# EasyEDA Pro project ProProject_Laser_Scanner_Logic_converter_2024-06-21.epro

# Schematic Schematic1

## Sheets
1 P1: Create Date: 2024-03-26; Page Name: P1; Project Name: Laser_Scanner_Logic_converter; Schematic Name: Schematic1; Update Date: 2024-04-04; Company: EasyEDA.com; Drawn: EasyEDA; Page Size: A4; Part Number: JLCPCB-002; Reviewed: EasyEDA; Version: V0.1
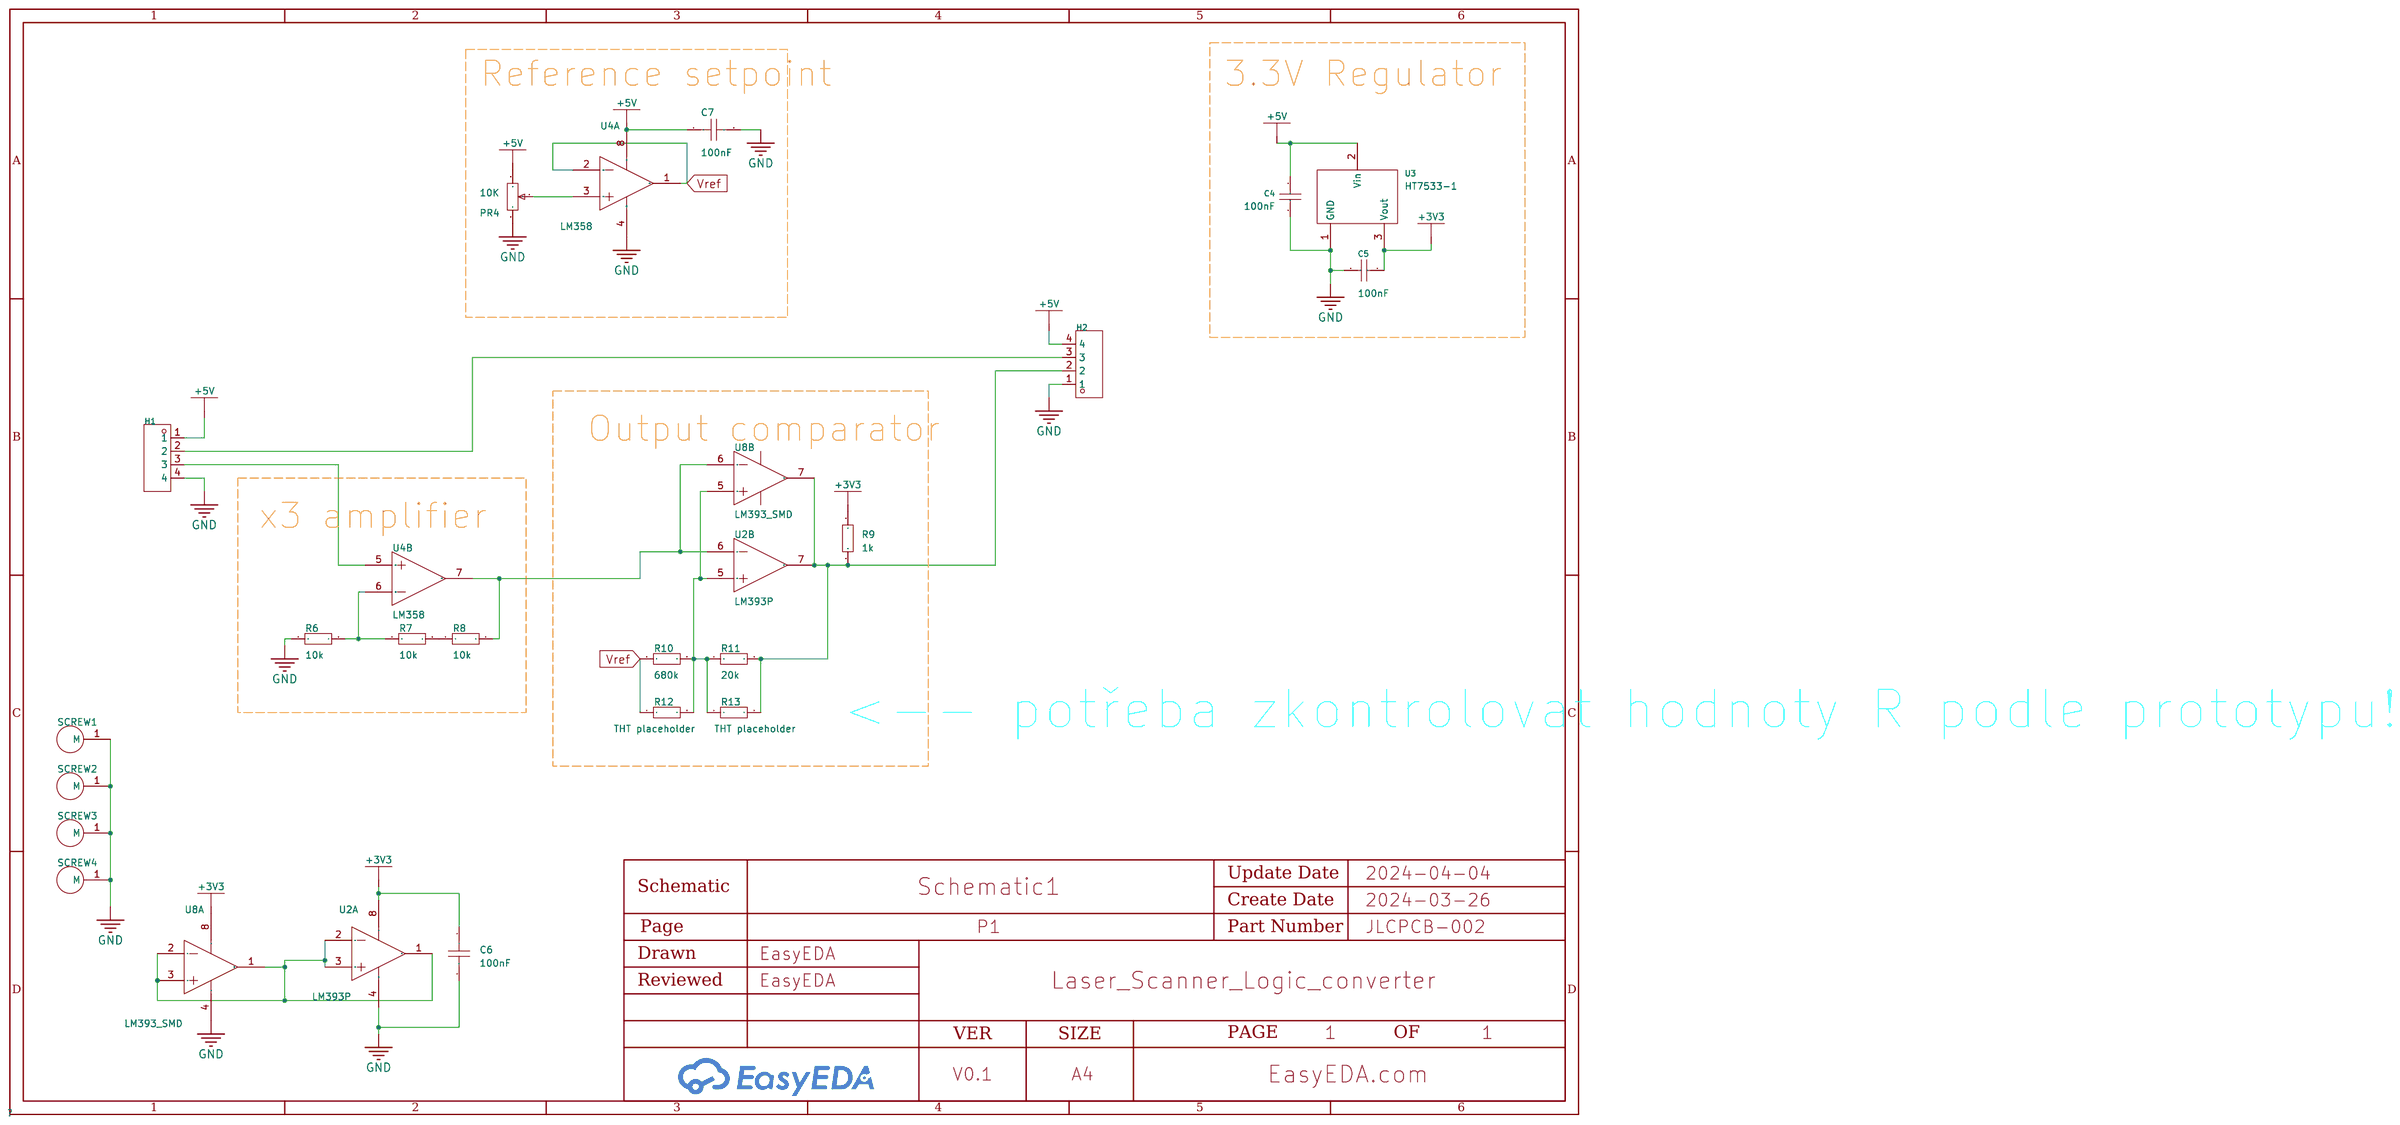
[diagram p0: P1]
2 flex breakout: Create Date: 2024-04-11; Page Name: flex breakout; Update Date: 2024-04-11
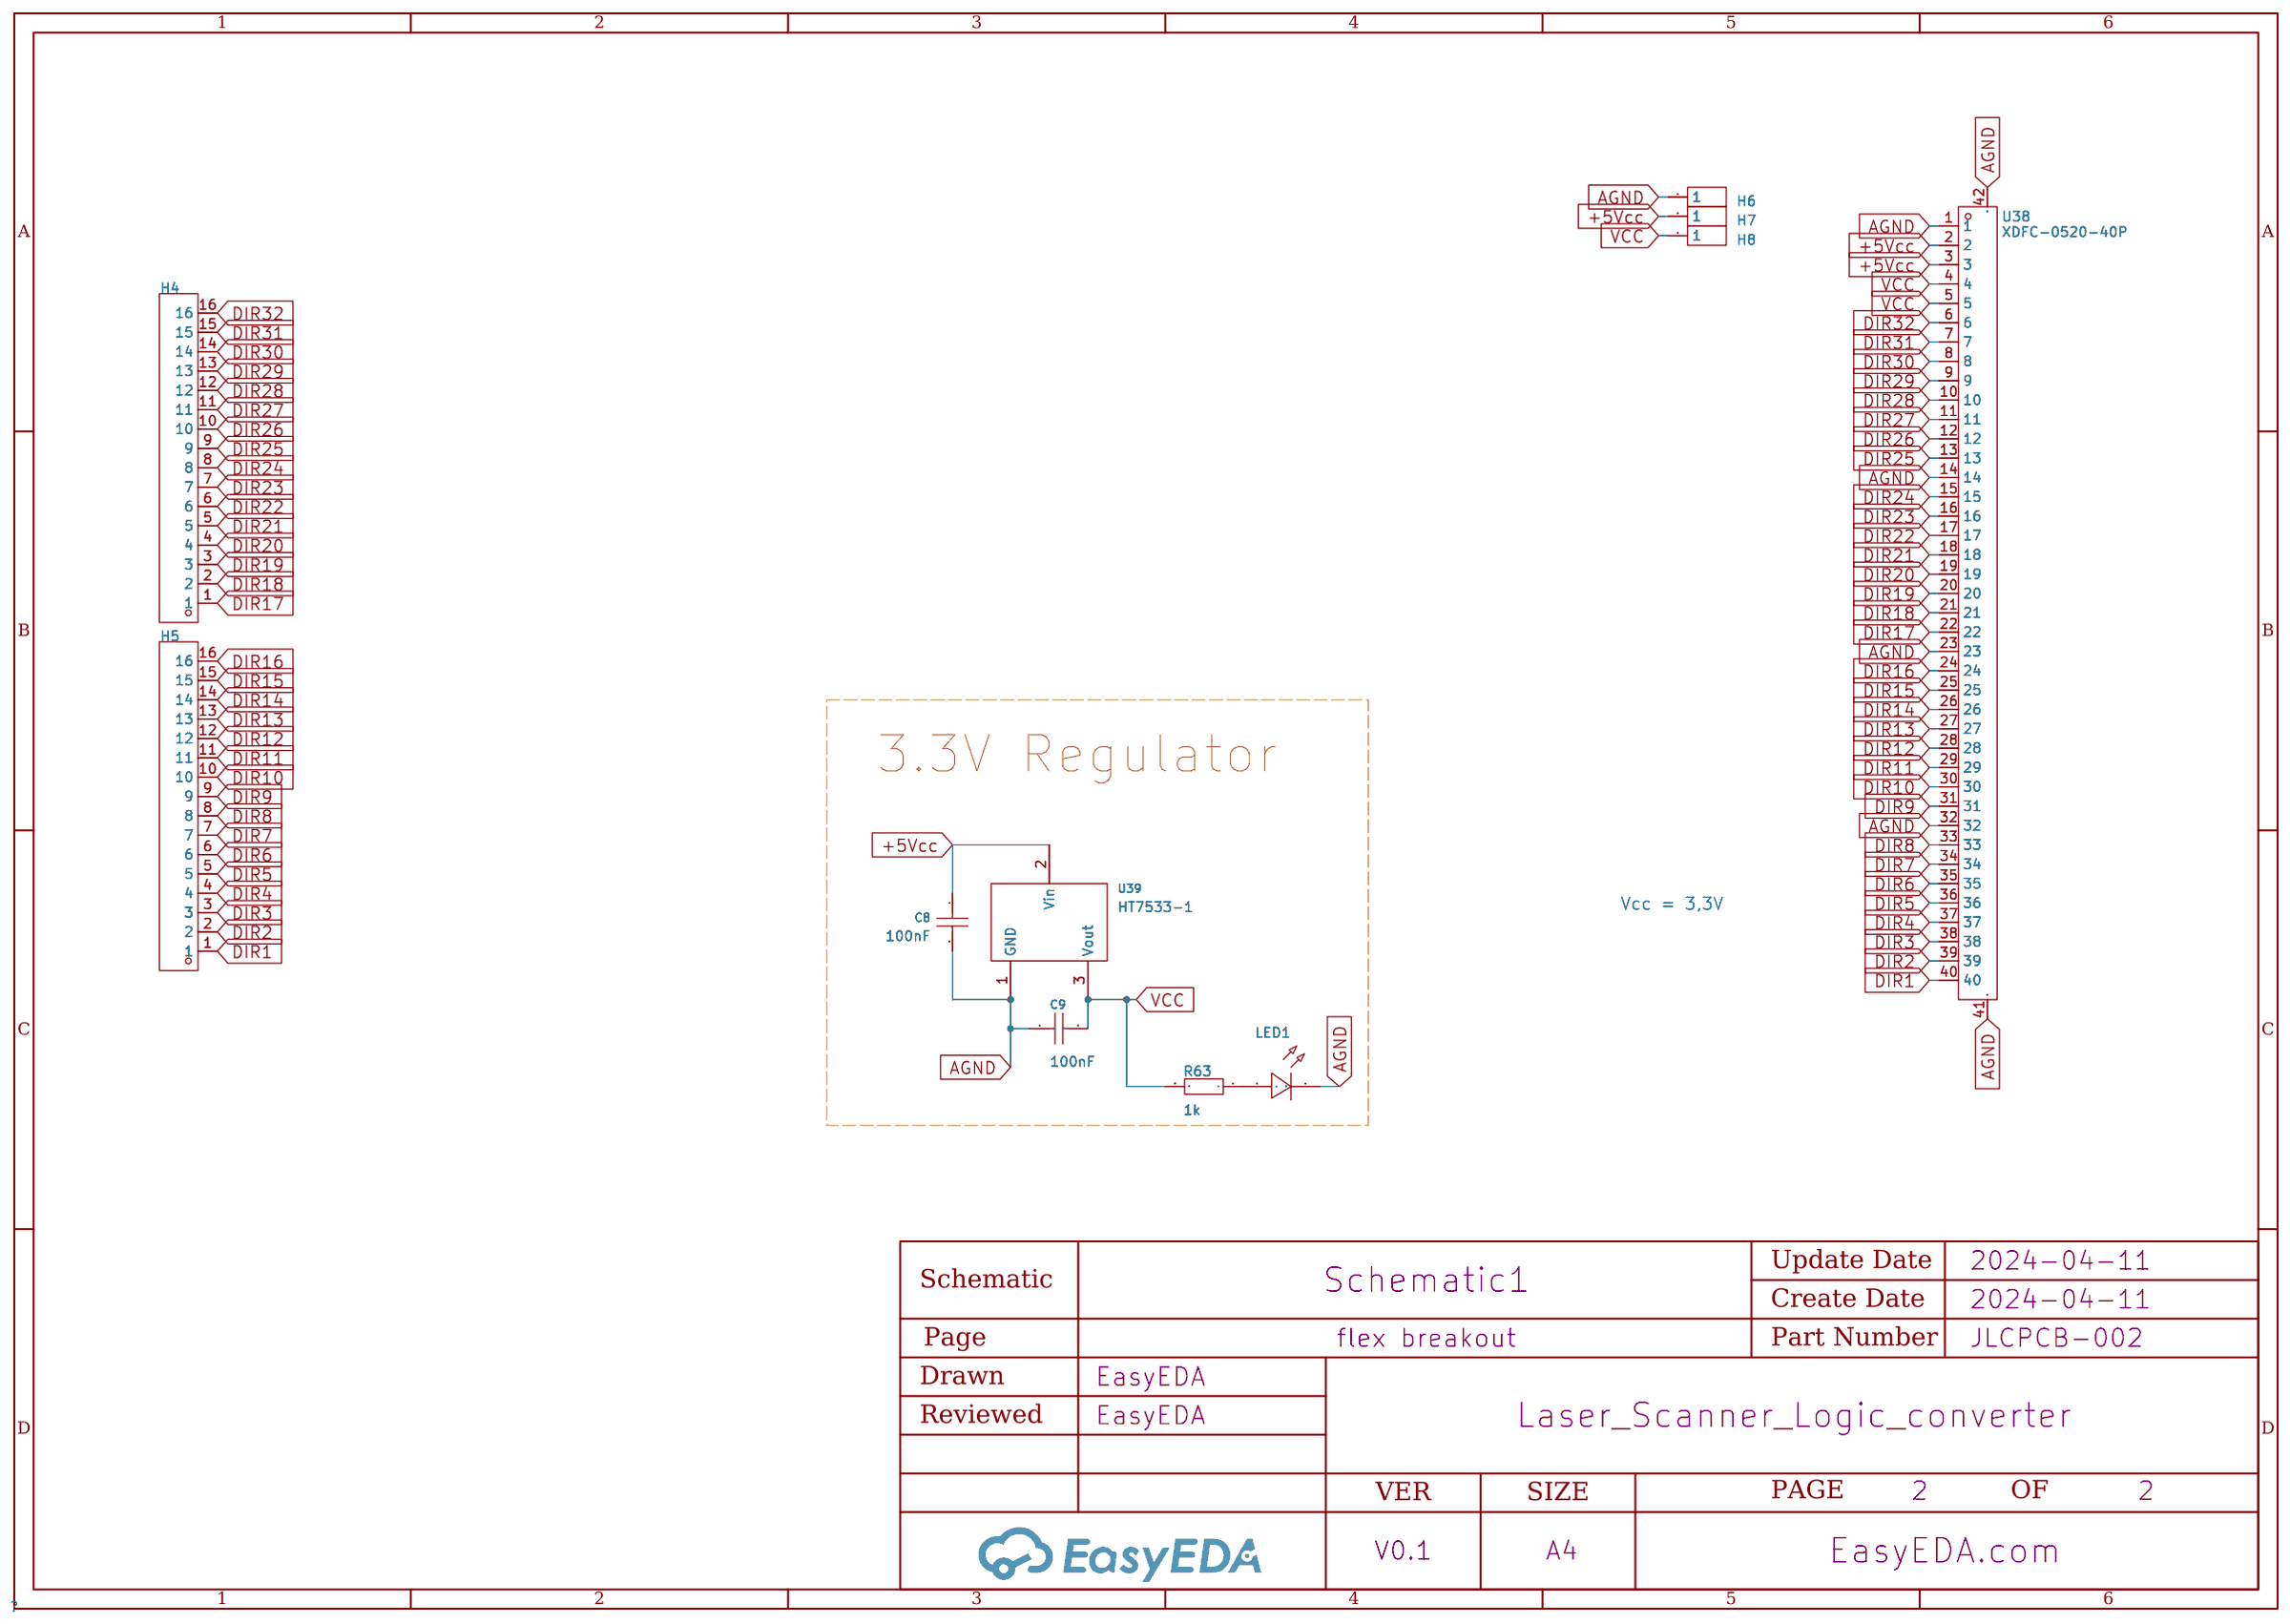
[diagram p1: flex breakout]

## Parts
sheet flex breakout
C8  100nF  [C0805]
C9  100nF  [C0805]
H4  -  [HDR-TH_16P-P2.54-V-M]
H5  -  [HDR-TH_16P-P2.54-V-M]
H6  -  [HDR-TH_1P-V-M_XKB_X4611WV-01I-C28D40]
H7  -  [HDR-TH_1P-V-M_XKB_X4611WV-01I-C28D40]
H8  -  [HDR-TH_1P-V-M_XKB_X4611WV-01I-C28D40]
LED1  -  [LED0805-RD_GREEN]
R63  1k  [R0603]
U38  XDFC-0520-40P  [conn-smd_40p-p0.50_f31l-1a7h1-21040]
U39  HT7533-1  [SOT-89-3_L4.5-W2.5-P1.50-LS4.2-BR]
sheet P1
C4  100nF  [C0805]
C5  100nF  [C0805]
C6  100nF  [C0805]
C7  100nF  [C0805]
H1  -  [Connector_JST:JST_XH_S04B-XH-A_1x04_P2.50mm_Horizontal]
H2  -  [Connector_JST:JST_XH_S04B-XH-A_1x04_P2.50mm_Horizontal]
PR4  10K  [RES-ADJ-SMD_3P-L3.8-W3.0_TC33X-2-302E]
R6  10k  [R0805]
R7  10k  [R0805]
R8  10k  [R0805]
R9  1k  [R0805]
R10  680k  [R0805]
R11  20k  [R0805]
R12  THT placeholder  [RESISTOR]
R13  THT placeholder  [RESISTOR]
SCREW1  -  [M3 MOUNTING HOLE]
SCREW2  -  [M3 MOUNTING HOLE]
SCREW3  -  [M3 MOUNTING HOLE]
SCREW4  -  [M3 MOUNTING HOLE]
U2  LM393P  [DIP-8_L10.1-W6.3-P2.54-LS7.6-BL-1]  (sections 1,2)
U3  HT7533-1  [SOT-89-3_L4.5-W2.5-P1.50-LS4.2-BR]
U4  LM358  [SOP-8_L4.9-W3.9-P1.27-LS6.0-BL]  (sections 1,2)
U8  LM393_SMD  [SOP-8_L4.9-W3.9-P1.27-LS6.0-BL]  (sections 1,2)

## Library data of the parts
C4 C5 C8 C9 = CL21B105KBFNNNE: Capacitance: Tolerance:±10% Tolerance:±10% Voltage Rated: Temperature Coefficient:; LCSC Part Name: 1uF ±10% 50V; Supplier Part: C28323; Manufacturer: SAMSUNG(三星); Supplier Footprint: 0805; JLCPCB Part Class: Basic Part; Datasheet: https://atta.szlcsc.com/upload/public/pdf/source/20160218/1457707763339.pdf; Supplier: LCSC; Tolerance: ±10%
H4 H5 = HDR-M_2.54_1x16P: Supplier Footprint: Through
H6-H8 = HDR-M_2.54_1x1P: Supplier Footprint: Through
LED1 = LED_0805-G: Supplier Footprint: 0805
R63 = Res_0603: Supplier Footprint: 0603
U38 = XDFC-0520-40P: Locking Feature:Clamshell Contact Type:Bottom Contact Number of Contacts:40P Pitch:0.5mm Mounting Type:卧贴 FFC, FCB Thickness:0.3mm FFC, FCB Thickness:0.3mm Height Above Board:2mm Contact Material:铜端 Contact Plating:Gold Operating Temperature Range:-40℃~+8; LCSC Part Name: FFC/FPC连接器 PH0.5-40PIN H2.0MM 翻盖式 下接/前翻; Supplier Part: C7527551; Manufacturer: LX(连欣科技); Supplier Footprint: SMD,P=0.5mm; JLCPCB Part Class: Extended Part; Datasheet: https://atta.szlcsc.com/upload/public/pdf/source/20230918/BC9D90A2478B1F11DE066C6B09D8BA06.pdf; Supplier: LCSC; Locking Feature: Clamshell; Contact Type: Bottom Contact; Number of Contacts: 40P; Pitch: 0.5mm; Mounting Type: 卧贴; FFC, FCB Thickness: 0.3mm; Height Above Board: 2mm; Contact Material: 铜端; Contact Plating: Gold; Operating Temperature Range: -40℃~+85℃; Soldering Temperature(Max): 265℃
U3 U39 = HT7533-1_C14289: Output Type: Maximum Input Voltage:30V Output Voltage:3.3V Output Voltage:3.3V MAX Output Current:100mA Power Supply Rejection Ratio (PSRR):- Dropout Voltage:55mV@(1mA) standby current:- Output Polarity:Positive electrode Number of Outputs:1; LCSC Part Name: 输入30V 输出3.3V 100mA; Supplier Part: C14289; Manufacturer: HOLTEK(合泰/盛群); Supplier Footprint: SOT-89-3; JLCPCB Part Class: Basic Part; Datasheet: https://atta.szlcsc.com/upload/public/pdf/source/20231219/BDECE6E78805324723A3C89E22CB6270.pdf; Supplier: LCSC; Maximum Input Voltage: 30V; Output Voltage: 3.3V; MAX Output Current: 100mA; Dropout Voltage: 55mV@(1mA); Output Polarity: Positive electrode; Number of Outputs: 1
C6 C7 = CAP_0805: Supplier Footprint: 0805
H1 H2 = HDR-F_2.54_1x4P: Supplier Footprint: Through
PR4 = R_3386P: Supplier Footprint: Through
R6-R13 = Res_0805: Supplier Footprint: 0805
SCREW1-SCREW4 = MOUNTING HOLE
U2 = LM393P: Input Offset Voltage (Vos):5mV Input Bias Current (Ib):250nA Input Hysteresis Voltage (Vhys):- Common Mode Rejection Ratio (CMRR):- Supply Voltage:1V~18V；2V~36V Supply Voltage:1V~18V；2V~36V Output Type:开集 Output Mode:- Supply Current:2.5mA Operating Tempe; Supplier Part: C5209; Manufacturer: TI(德州仪器); Supplier Footprint: PDIP-8; JLCPCB Part Class: Extended Part; Datasheet: https://www.ti.com/cn/lit/gpn/lm393; Supplier: LCSC; Input Offset Voltage (Vos): 5mV; Input Bias Current (Ib): 250nA; Supply Voltage: 1V~18V；2V~36V; Output Type: 开集; Supply Current: 2.5mA; Operating Temperature: 0℃~+70℃
U4 = LM358: Supplier Part: C2984960; Manufacturer: HX(恒佳兴); Supplier Footprint: SOP-8; JLCPCB Part Class: Extended Part; Datasheet: https://atta.szlcsc.com/upload/public/pdf/source/20220411/BF8A74874B47C6BB2B58E6B995D1DE82.pdf; Supplier: LCSC
U8 = LM393_C400839: Input Offset Voltage (Vos):3mV Input Bias Current (Ib):- Propagation Delay Time:- Input Hysteresis Voltage (Vhys):- Common Mode Rejection Ratio (CMRR):- Supply Voltage:24V Supply Voltage:24V Output Type:- Output Mode:- Rail-to-Rail:- Supply Current:2.5mA; LCSC Part Name: LM393; Supplier Part: C400839; Manufacturer: IDCHIP(英锐芯); Supplier Footprint: SOP-8; JLCPCB Part Class: Extended Part; Datasheet: https://atta.szlcsc.com/upload/public/pdf/source/20190624/C400839_FC3E4757065A64BC24F9F0B8EF99EFFB.pdf; Supplier: LCSC; Input Offset Voltage (Vos): 3mV; Supply Voltage: 24V; Supply Current: 2.5mA

## Nets
+3V3: C5.2 C6.1 R9.1 U2.8(VCC) U3.3(Vout) U8.8(VCC)
+5V: C4.1 C7.1 H1.1 H2.4 PR4.3 U3.2(Vin) U4.8(Vcc)
+5Vcc: C8.1 H7.1 U38.2 U38.3 U39.2(Vin)
AGND: C8.2 C9.1 H6.1 LED1.1(C) U38.1 U38.14 U38.23 U38.32 U38.41 U38.42 U39.1(GND)
GND: C4.2 C5.1 C6.2 C7.2 H1.4 H2.1 PR4.1 R6.1 SCREW1.1(M) SCREW2.1(M) SCREW3.1(M) SCREW4.1(M) U2.4(GND) U3.1(GND) U4.4(VEE / GND) U8.4(GND)
VCC: C9.2 H8.1 R63.2 U38.4 U38.5 U39.3(Vout)
DIR1: H5.1 U38.40
DIR2: H5.2 U38.39
DIR3: H5.3 U38.38
DIR4: H5.4 U38.37
DIR5: H5.5 U38.36
DIR6: H5.6 U38.35
DIR7: H5.7 U38.34
DIR8: H5.8 U38.33
DIR9: H5.9 U38.31
DIR10: H5.10 U38.30
DIR11: H5.11 U38.29
DIR12: H5.12 U38.28
DIR13: H5.13 U38.27
DIR14: H5.14 U38.26
DIR15: H5.15 U38.25
DIR16: H5.16 U38.24
DIR17: H4.1 U38.22
DIR18: H4.2 U38.21
DIR19: H4.3 U38.20
DIR20: H4.4 U38.19
DIR21: H4.5 U38.18
DIR22: H4.6 U38.17
DIR23: H4.7 U38.16
DIR24: H4.8 U38.15
DIR25: H4.9 U38.13
DIR26: H4.10 U38.12
DIR27: H4.11 U38.11
DIR28: H4.12 U38.10
DIR29: H4.13 U38.9
DIR30: H4.14 U38.8
DIR31: H4.15 U38.7
DIR32: H4.16 U38.6
Vref: R10.1 R12.1 U4.1(OUTPUT 1) U4.2(INPUT1(-))
$1N1233: H1.3 U4.5(INPUT2(+)
$1N3163: H1.2 H2.3
$1N3429: PR4.2 U4.3(INPUT1(+))
$1N3524: R7.2 R8.1
$1N3535: R6.2 R7.1 U4.6(INPUT2(-))
$1N4775: H2.2 R9.2 R11.2 R13.2 U2.7(2OUT) U8.7(OUTB)
$1N4786: R10.2 R11.1 R12.2 R13.1 U2.5(2IN+) U8.5(INB+)
$1N4803: R8.2 U2.6(2IN-) U4.7(OUTPUT2) U8.6(INB-)
$1N5231: U2.1(1OUT) U2.2(1IN-) U2.3(1IN+) U8.1(OUTA) U8.2(INA-) U8.3(INA+)
$2N2352: LED1.2(A) R63.1

## Notes on the sheets
sheet 1
- Reference setpoint
- 3.3V Regulator
- Output comparator
- x3 amplifier
- <-- potřeba zkontrolovat hodnoty R podle prototypu!
sheet 2
- 3.3V Regulator
- Vcc = 3,3V

# Board PCB1
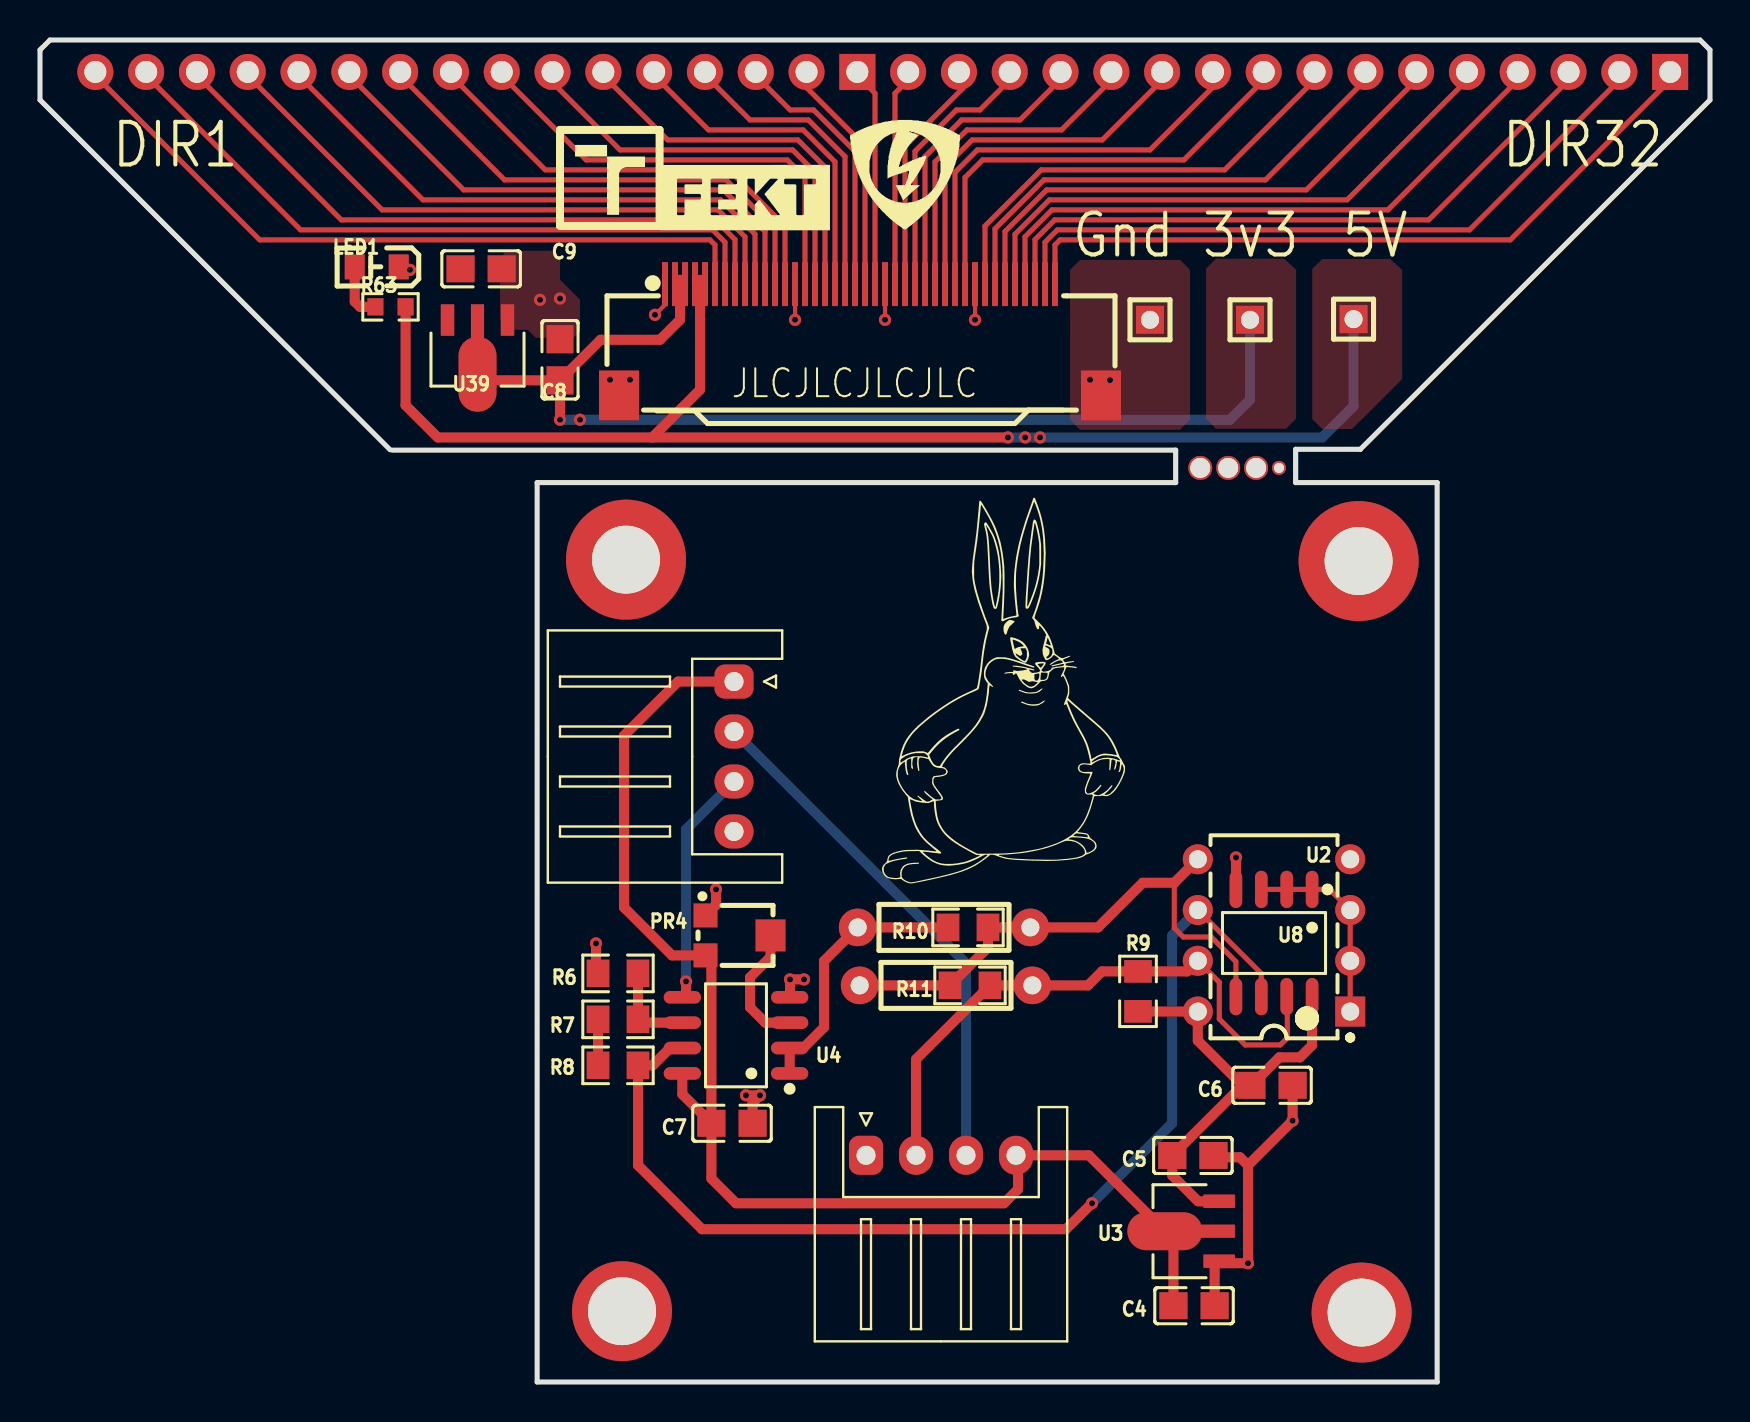
[diagram p2: board, top side]
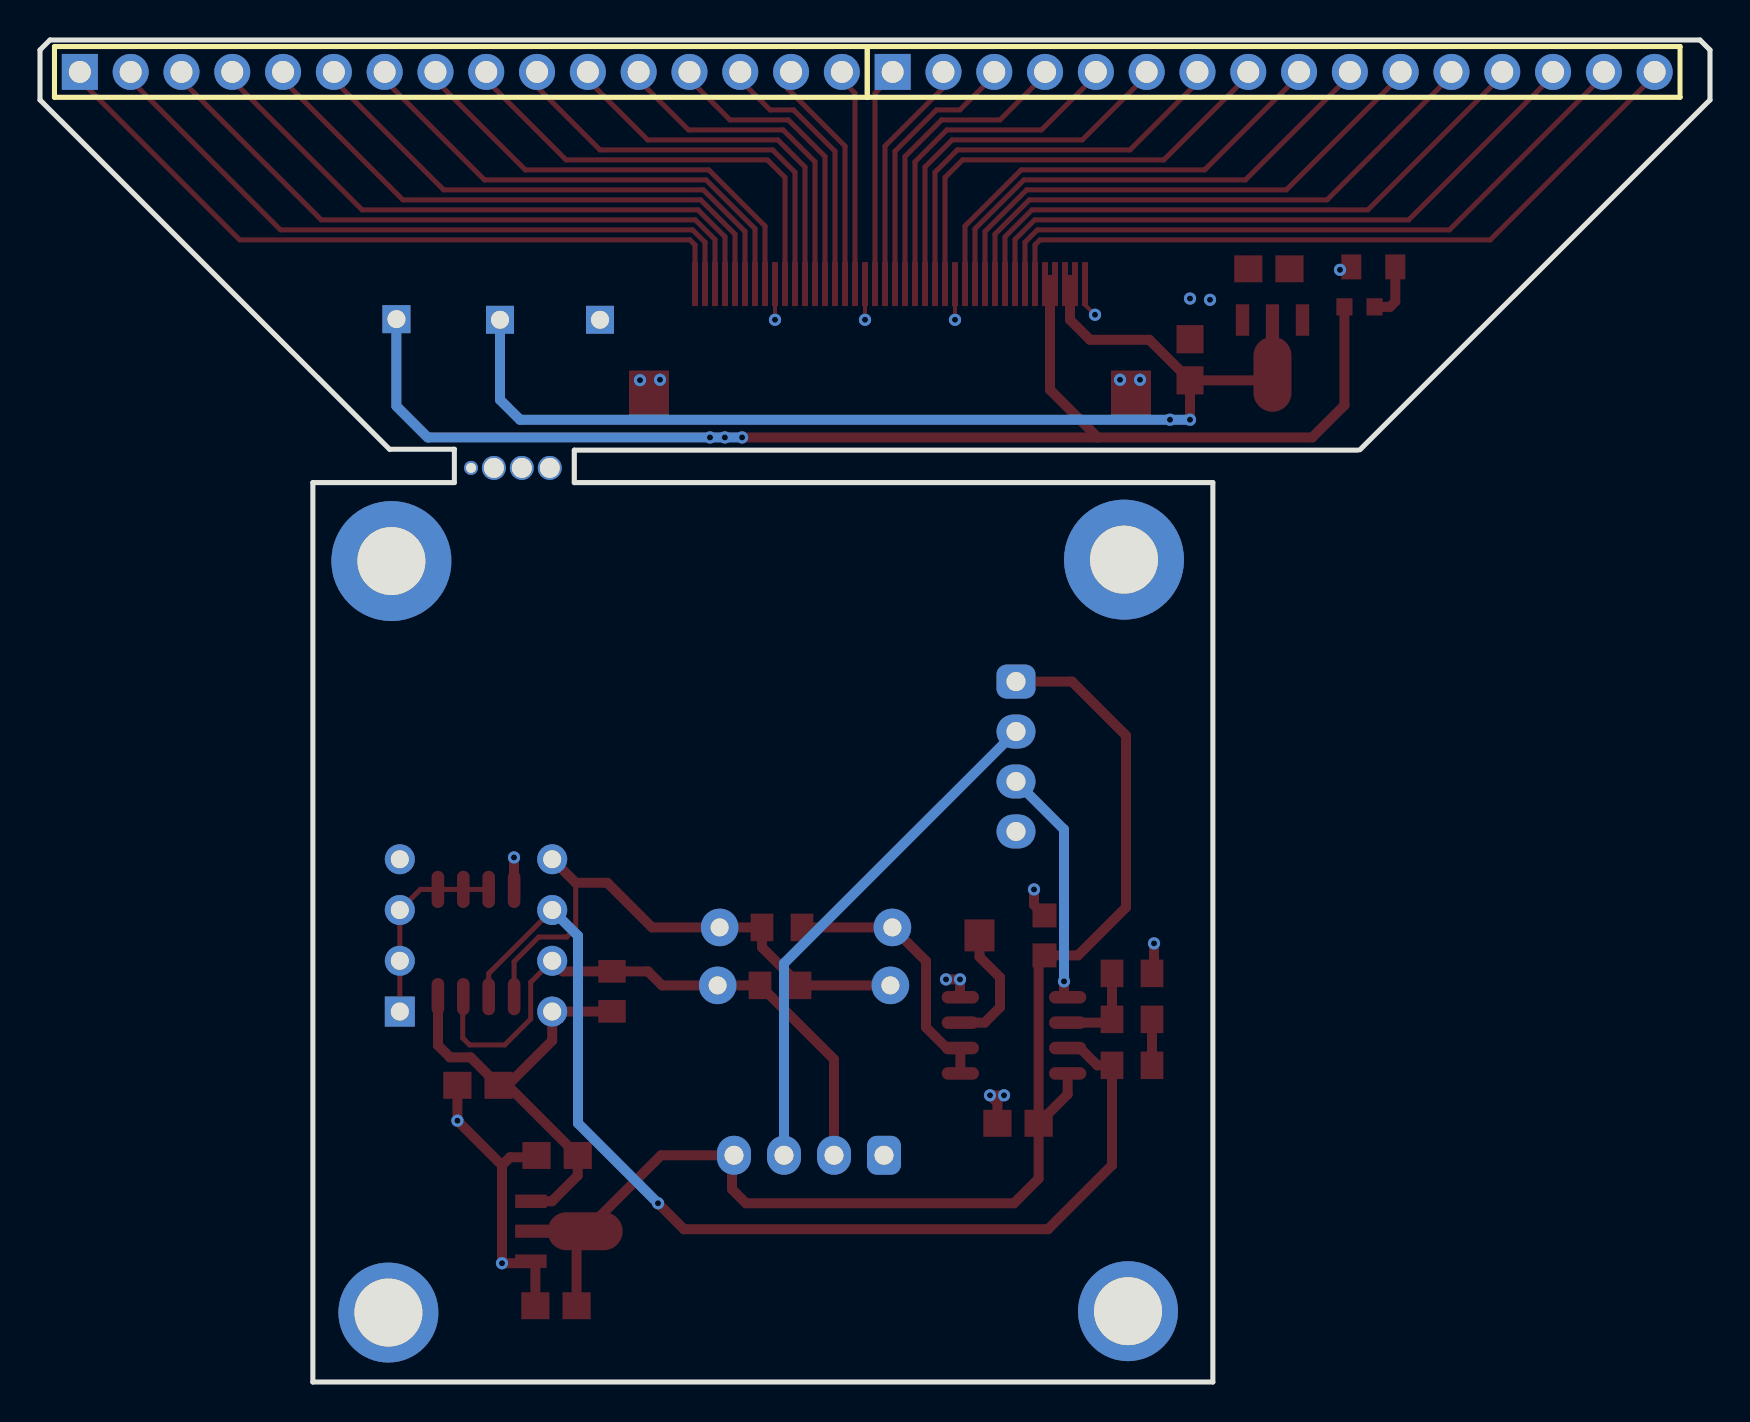
[diagram p3: board, bottom side, seen from below]

Outline 83.5 x 67.15 mm; copper layers: Top Layer, Bottom Layer. Coordinates in mm from the lower left corner of the outline.
Outline path: 17.5,46.65 0,64.15 0,66.64 0.5,67.15 83,67.15 83.5,66.65 83.5,64.15 66.02,46.67 62.78,46.67 62.78,45 69.86,45 69.86,0 24.86,0 24.86,45 56.78,45 56.78,46.62 17.61,46.62
Stack: Top Layer 0.035mm / Dielectric1 1.51mm FR4 er 4.5 / Bottom Layer 0.035mm

## Design rules (mm)
template: Custom Config
spacing copperThickness1oz (default): track to track 0.102, other pairs 0.152 to 0.3
spacing copperThickness2oz: track to track 0.203, other pairs 0.152 to 0.3
track width copperThickness1oz (default): min 0.127, default 0.254, max 2.54
track width copperThickness2oz: min 0.203, default 0.254, max 2.54
differential pair differentialPair (default): width min 0.127, default 0.254, max 2.54; gap min 0.152, default 0.152
via viaSize (default): diameter min 0.5, default 0.61, max 10; hole min 0.3, default 0.305, max 6.3
pour e905 uses no_thermal_relief

## Placement (name value [footprint] x y rotation side)
C4  100nF  [C0805]  57.7 3.82 0 top
C5  100nF  [C0805]  57.64 11.34 180 top
C6  100nF  [C0805]  61.6 14.85 0 top
C7  100nF  [C0805]  34.6 12.95 0 top
C8  100nF  [C0805]  26 51.15 90 top
C9  100nF  [C0805]  22.06 55.7 180 top
H1  -  [Connector_JST:JST_XH_S04B-XH-A_1x04_P2.50mm_Horizontal]  34.7 35.05 270 top
H2  -  [Connector_JST:JST_XH_S04B-XH-A_1x04_P2.50mm_Horizontal]  41.3 11.35 0 top
H4  -  [HDR-TH_16P-P2.54-V-M]  21.82 65.55 180 bottom
H5  -  [HDR-TH_16P-P2.54-V-M]  62.46 65.55 180 bottom
H6  -  [HDR-TH_1P-V-M_XKB_X4611WV-01I-C28D40]  55.5 53.15 180 top
H7  -  [HDR-TH_1P-V-M_XKB_X4611WV-01I-C28D40]  60.5 53.15 180 top
H8  -  [HDR-TH_1P-V-M_XKB_X4611WV-01I-C28D40]  65.68 53.18 180 top
LED1  -  [LED0805-RD_GREEN]  16.84 55.79 180 top
NOREF  -  [Pad_e888]  60.81 45.74 0 top
NOREF#2  -  [Pad_e887]  59.41 45.74 0 top
NOREF#3  -  [Pad_e884]  58.01 45.74 0 top
NOREF#4  -  [Pad_e889]  61.95 45.74 0 top
PR4  10K  [RES-ADJ-SMD_3P-L3.8-W3.0_TC33X-2-302E]  34.9 22.35 270 top
R6  10k  [R0805]  28.9 20.45 0 top
R7  10k  [R0805]  28.9 18.15 180 top
R8  10k  [R0805]  28.9 15.85 0 top
R9  1k  [R0805]  54.9 19.55 90 top
R10  680k  [R0805]  46.4 22.75 0 top
R11  20k  [R0805]  46.5 19.85 0 top
R12  THT placeholder  [RESISTOR]  45.2 22.75 0 top
R13  THT placeholder  [RESISTOR]  45.3 19.85 0 top
R63  1k  [R0603]  17.53 53.79 0 top
SCREW1  -  [m3 mounting hole#2]  29.3 41.15 0 top
SCREW2  -  [m3 mounting hole#2]  65.93 41.08 0 top
SCREW3  -  [m3 mounting hole]  29.1 3.55 0 top
SCREW4  -  [m3 mounting hole]  66.08 3.48 0 top
U2  LM393P  [DIP-8_L10.1-W6.3-P2.54-LS7.6-BL-1]  61.7 22.35 90 top
U3  HT7533-1  [SOT-89-3_L4.5-W2.5-P1.50-LS4.2-BR]  57.6 7.55 0 top
U4  LM358  [SOP-8_L4.9-W3.9-P1.27-LS6.0-BL]  34.8 17.35 90 top
U8  LM393_SMD  [SOP-8_L4.9-W3.9-P1.27-LS6.0-BL]  61.7 21.96 180 top
U38  XDFC-0520-40P  [conn-smd_40p-p0.50_f31l-1a7h1-21040]  41 52.15 0 top
U39  HT7533-1  [SOT-89-3_L4.5-W2.5-P1.50-LS4.2-BR]  21.88 51.78 90 top

## Footprints (pads in the part's own frame, mm; a bottom-side part is the same pattern mirrored in y, then rotated)
C0805
  rect 1.41x1.35 smd: 1(-1.03,0) 2(1.03,0)
conn-smd_40p-p0.50_f31l-1a7h1-21040
  rect 0.3x2.2 smd: 1(-9.75,2.788) 2(-9.25,2.788) 3(-8.75,2.788) 4(-8.25,2.788) 5(-7.75,2.788) 6(-7.25,2.788) 7(-6.75,2.788) 8(-6.25,2.788) 9(-5.75,2.788) 10(-5.25,2.788) 11(-4.75,2.788) 12(-4.25,2.788) 13(-3.75,2.788) 14(-3.25,2.788) 15(-2.75,2.788) 16(-2.25,2.788) 17(-1.75,2.788) 18(-1.25,2.788) 19(-0.75,2.788) 20(-0.25,2.788) 21(0.25,2.788) 22(0.75,2.788) 23(1.25,2.788) 24(1.75,2.788) 25(2.25,2.788) 26(2.75,2.788) 27(3.25,2.788) 28(3.75,2.788) 29(4.25,2.788) 30(4.75,2.788) 31(5.25,2.788) 32(5.75,2.788) 33(6.25,2.788) 34(6.75,2.788) 35(7.25,2.788) 36(7.75,2.788) 37(8.25,2.788) 38(8.75,2.788) 39(9.25,2.788) 40(9.75,2.788)
  rect 2x2.5 smd: 41(-12.05,-2.788) 42(12.05,-2.788)
Connector_JST:JST_XH_S04B-XH-A_1x04_P2.50mm_Horizontal
  rrect 1.7x1.95 hole 0.95: 1(0,0)
  oval 1.7x1.95 hole 0.95: 2(2.5,0) 3(5,0) 4(7.5,0)
DIP-8_L10.1-W6.3-P2.54-LS7.6-BL-1
  rect 1.5x1.5 hole 0.9: 1(-3.81,-3.81)
  round 1.5 hole 0.9: 2(-1.27,-3.81) 3(1.27,-3.81) 4(3.81,-3.81) 5(3.81,3.81) 6(1.27,3.81) 7(-1.27,3.81) 8(-3.81,3.81)
HDR-TH_1P-V-M_XKB_X4611WV-01I-C28D40
  rect 1.4x1.4 hole 0.9: 1(0,0)
HDR-TH_16P-P2.54-V-M
  rect 1.8x1.8 hole 1.1: 1(-19.05,0)
  round 1.8 hole 1.1: 2(-16.51,0) 3(-13.97,0) 4(-11.43,0) 5(-8.89,0) 6(-6.35,0) 7(-3.81,0) 8(-1.27,0) 9(1.27,0) 10(3.81,0) 11(6.35,0) 12(8.89,0) 13(11.43,0) 14(13.97,0) 15(16.51,0) 16(19.05,0)
LED0805-RD_GREEN
  rect 1x1.25 smd: 1(-1.1,0) 2(1.1,0)
m3 mounting hole
  round 5 hole 3.4: 1(0,0)
m3 mounting hole#2
  round 6 hole 3.4: 1(0,0)
Pad_e884
  round 1.2 hole 1: 43(0,0)
Pad_e887
  round 1.2 hole 1: 43(0,0)
Pad_e888
  round 1.2 hole 1: 43(0,0)
Pad_e889
  round 0.7 hole 0.5: 43(0,0)
R0603
  rect 0.806x0.864 smd: 1(-0.753,0) 2(0.753,0)
R0805
  rect 1.133x1.377 smd: 1(-1,0) 2(1,0)
RES-ADJ-SMD_3P-L3.8-W3.0_TC33X-2-302E
  rect 1.2x1.2 smd: 1(-1,-1.625) 3(1,-1.625)
  rect 1.6x1.5 smd: 2(0,1.625)
RESISTOR
  round 1.879 hole 0.899: 1(-4.318,0) 2(4.318,0)
SOP-8_L4.9-W3.9-P1.27-LS6.0-BL
  oval 0.63x1.865 smd: 1(-1.905,-2.683) 2(-0.635,-2.683) 3(0.635,-2.683) 4(1.905,-2.683) 5(1.905,2.683) 6(0.635,2.683) 7(-0.635,2.683) 8(-1.905,2.683)
SOT-89-3_L4.5-W2.5-P1.50-LS4.2-BR
  rect 1.575x0.672 smd: 1(1.356,-1.5) 3(1.356,1.5)
  custom 5.377x1.9 smd: 2(-1.356,0)

## Nets
As in the schematic, except:
+5VCC: C8.1 H7.1 U38.2 U38.3 U39.2
VREF: R10.1 R12.1 U4.1 U4.2

Pads without a net: NOREF 43; NOREF#2 43; NOREF#3 43; NOREF#4 43

## Via types
v1: diameter 0.61, hole 0.305, Top Layer to Bottom Layer, 27 vias

## Routing (per net, layer and track width the routed paths; a pad name or vN(x,y) marks a point on that pad's centre or on a via; arc(x,y) is an arc through that point)
+3V3: length 23.2
  Top Layer w0.5: U3.3 57.9,9.05 56.61,10.33 C5.2 60.12,14.85 ; R9.1 54.91,18.54 U2.8 57.89,17.08 60.12,14.85 ; 60.12,14.85 C6.1 61.97,16.25 63,16.25 63.6,16.85 63.6,19.28 U8.8
+5V: length 65.5
  Top Layer w0.5: C7.1 32.12,14.4 U4.8 ; C7.1 33.57,21.05 PR4.3 31.6,21.35 29.2,23.75 29.2,32.35 31.9,35.05 H1.1 ; C7.1 33.57,10.18 34.8,8.95 48.2,8.95 48.9,9.65 48.9,11.25 H2.4 52.44,11.35 U3.2 56.67,7.12 C4.1
+5VCC: length 54.4
  Top Layer w0.5: C8.1 28.03,52.15 31,52.15 32,53.15 32,55.15 ; C8.1 22.18,50.12 U39.2 ; C8.1 v1(26,48.15)
  Bottom Layer w0.5: H7.1 60.5,49.15 59.5,48.15 v1(27,48.15) v1(26,48.15)
AGND: length 7.1
  Top Layer w0.2: U38.1 31.25,53.9 v1(30.75,53.4) ; v1(46.75,53.15) U38.32 ; v1(37.75,53.15) U38.14 ; v1(42.25,53.15) U38.23
  vias: v1(18.5,55.65) v1(25,54.15) v1(26,54.21) v1(28.5,50.15) v1(29.5,50.15) v1(52.5,50.15) v1(53.5,50.13)
GND: length 24.1
  Top Layer w0.5: C5.1 58.77,11.25 60,11.25 60.4,10.85 ; v1(27.8,21.95) 27.8,20.55 R6.1 ; 60.4,10.85 v1(60.4,5.95) 59.06,5.95 U3.1 58.73,5.82 C4.2 ; 60.4,10.85 v1(62.63,13.08) C6.2 ; C7.2 35.63,13.98 v1(36,14.35) v1(35.3,14.35) ; v1(38.2,20.15) v1(37.5,20.15) 37.5,19.27 U4.4 ; v1(33.8,24.65) 33.8,23.87 PR4.1 ; U8.4 59.8,24.65 v1(59.8,26.25)
VCC: length 66.9
  Top Layer w0.5: 33,55.15 33,49.65 30.61,47.26 ; 30.61,47.26 19.89,47.26 18.28,48.87 R63.2 ; 30.61,47.26 v1(48.4,47.26)
  Bottom Layer w0.5: H8.1 65.68,48.82 64.11,47.26 v1(50,47.26) v1(49.26,47.26) v1(48.4,47.26)
DIR1: length 36.4
  Top Layer w0.254: 81.7,65.33 73.51,57.14 51,57.14 50.75,56.89 U38.40
DIR2: length 34.4
  Top Layer w0.254: U38.39 50.25,57.03 50.87,57.65 71.47,57.65 79.16,65.33
DIR3: length 32.5
  Top Layer w0.254: U38.38 49.75,57.16 50.74,58.15 69.44,58.15 76.62,65.33
DIR4: length 30.5
  Top Layer w0.254: 74.08,65.33 67.4,58.65 50.6,58.65 49.25,57.3 U38.37
DIR5: length 28.6
  Top Layer w0.254: U38.36 48.75,57.43 50.47,59.15 65.35,59.15 71.54,65.33
DIR6: length 26.6
  Top Layer w0.254: 69,65.33 63.31,59.65 50.33,59.65 48.25,57.57 U38.35
DIR7: length 24.6
  Top Layer w0.254: 66.46,65.33 61.28,60.15 50.19,60.15 47.75,57.7 U38.34
DIR8: length 22.7
  Top Layer w0.254: U38.33 47.25,57.84 50.06,60.65 59.24,60.65 63.92,65.33
DIR9: length 22.6
  Top Layer w0.254: U38.31 46.25,60.26 47.13,61.15 57.19,61.15 61.38,65.33
DIR10: length 20.9
  Top Layer w0.254: 58.84,65.33 58.84,64.99 55.5,61.65 46.87,61.65 45.75,60.53 U38.30
DIR11: length 18.8
  Top Layer w0.254: U38.29 45.25,60.79 46.61,62.15 53.12,62.15 56.3,65.33
DIR12: length 16.9
  Top Layer w0.254: 53.76,65.33 51.07,62.65 46.34,62.65 44.75,61.05 U38.28
DIR13: length 15
  Top Layer w0.254: 51.22,65.33 51.19,65.33 49,63.14 46.08,63.14 44.25,61.31 U38.27
DIR14: length 13.1
  Top Layer w0.254: U38.26 43.75,61.57 45.82,63.65 47,63.65 48.68,65.33
DIR15: length 11.6
  Top Layer w0.254: 46.14,65.33 46.14,64.73 43.25,61.84 U38.25
DIR16: length 10.8
  Top Layer w0.254: U38.24 42.75,64.48 43.6,65.33
DIR17: length 10.8
  Top Layer w0.254: 40.9,65.33 41.75,64.48 U38.22
DIR18: length 11.6
  Top Layer w0.254: 38.36,65.33 38.36,64.73 41.25,61.84 U38.21
DIR19: length 13.1
  Top Layer w0.254: 35.82,65.33 37.51,63.65 38.68,63.65 40.75,61.57 U38.20
DIR20: length 15
  Top Layer w0.254: U38.19 40.25,61.31 38.42,63.14 35.5,63.14 33.31,65.33 33.28,65.33
DIR21: length 16.9
  Top Layer w0.254: U38.18 39.75,61.05 38.16,62.65 33.43,62.65 30.74,65.33
DIR22: length 18.8
  Top Layer w0.254: U38.17 39.25,60.79 37.89,62.15 31.39,62.15 28.2,65.33
DIR23: length 20.9
  Top Layer w0.254: 25.66,65.33 25.66,64.99 29,61.65 37.63,61.65 38.75,60.53 U38.16
DIR24: length 22.6
  Top Layer w0.254: U38.15 38.25,60.26 37.37,61.15 27.31,61.15 23.12,65.33
DIR25: length 22.7
  Top Layer w0.254: 20.58,65.33 25.27,60.65 34.44,60.65 37.25,57.84 U38.13
DIR26: length 24.6
  Top Layer w0.254: 18.04,65.33 23.23,60.15 34.31,60.15 36.75,57.7 U38.12
DIR27: length 26.6
  Top Layer w0.254: U38.11 36.25,57.57 34.17,59.65 21.19,59.65 15.5,65.33
DIR28: length 28.6
  Top Layer w0.254: 12.96,65.33 19.15,59.15 34.03,59.15 35.75,57.43 U38.10
DIR29: length 30.5
  Top Layer w0.254: 10.42,65.33 17.11,58.65 33.9,58.65 35.25,57.3 U38.9
DIR30: length 32.5
  Top Layer w0.254: 7.88,65.33 15.07,58.15 33.76,58.15 34.75,57.16 U38.8
DIR31: length 34.4
  Top Layer w0.254: 5.34,65.33 13.03,57.65 33.63,57.65 34.25,57.03 U38.7
DIR32: length 36.4
  Top Layer w0.254: 2.8,65.33 10.99,57.14 33.5,57.14 33.75,56.89 U38.6
VREF: length 13.6
  Top Layer w0.5: U4.1 U4.2 38.16,16.71 39.2,17.75 39.2,21.06 R12.1 R10.1
$1N1233: length 11.9
  Top Layer w0.5: U4.5 32.3,19.43 v1(32.3,20.05)
  Bottom Layer w0.5: v1(32.3,20.05) 32.3,27.65 H1.3
$1N3163: length 26
  Bottom Layer w0.5: H2.3 46.3,20.95 H1.2
$1N3429: length 6.3
  Top Layer w0.5: U4.3 36.26,17.98 35.5,18.75 35.5,20.25 36.53,21.27 PR4.2
$1N3524: length 2.3
  Top Layer w0.5: R8.1 R7.2
$1N3535: length 4.6
  Top Layer w0.5: R6.2 R7.1 30.06,17.98 U4.6
$1N4775: length 30.5
  Top Layer w0.254: 62.34,19.28 62.36,19.25 62.36,17.21 62.01,16.86 60.26,16.86 58.96,18.16 58.96,20 U2.7
  Top Layer w0.5: U2.7 57.36,20.55 R9.2 53.1,20.55 52.4,19.85 R13.2 R11.2 43.8,16.15 H2.2
$1N4786: length 27.9
  Top Layer w0.254: U8.5 59.79,21.03 58.56,22.26 57.16,22.26 56.71,22.71 56.71,24.98
  Top Layer w0.5: U2.5 56.71,24.98 55.13,24.98 52.9,22.75 R12.2 R10.2 47.4,21.75 R11.1 R13.1
$1N4803: length 54.6
  Top Layer w0.254: U8.6 61.06,20.44 U2.6
  Top Layer w0.5: v1(52.6,8.95) 51.3,7.65 33.1,7.65 29.9,10.85 R8.2 30.63,15.85 31.5,16.71 U4.7
  Bottom Layer w0.5: U2.6 56.6,22.33 56.6,12.95 v1(52.6,8.95)
$1N5231: length 10
  Top Layer w0.254: U8.3 U8.1 64.48,24.65 U2.3 U2.2 U2.1
$2N2352: length 2.9
  Top Layer w0.5: R63.1 16,53.79 15.74,54.06 LED1.2

## Copper pours and planes (outline as drawn; the poured copper is in the pictures)
+5VCC on Top Layer: 58.3,56.2 62.8,56.2 62.8,47.7 58.3,47.7
AGND on Top Layer: 23,56.6 27,56.6 27,52.25 23,52.25
AGND on Top Layer: 51.5,56.15 57.5,56.15 57.5,47.65 51.5,47.65
AGND on Bottom Layer: 3.5,57.15 87.5,57.15 87.5,49.15 3.5,49.15
GND on Top Layer: 20.5,45.15 98,45.15 98,-6.85 20.5,-6.85
VCC on Top Layer: 18.43,54.14 18.43,52.88 19,50.65 20.34,52.48 20.5,52.65 21.66,54.79 20.42,56.82 19.21,56.65 19.5,54.65 18.46,54.14
VCC on Top Layer: 63.61,56.18 68.11,56.18 68.11,47.68 63.61,47.68

## Text on the board
Top Silkscreen Layer: JLCJLCJLCJLC | Gnd | 3v3 | 5V | DIR1 | DIR32
